# Altium schematic sheet Actionneur.SchDoc
size A4; SheetNumber: 6; SheetTotal: 7
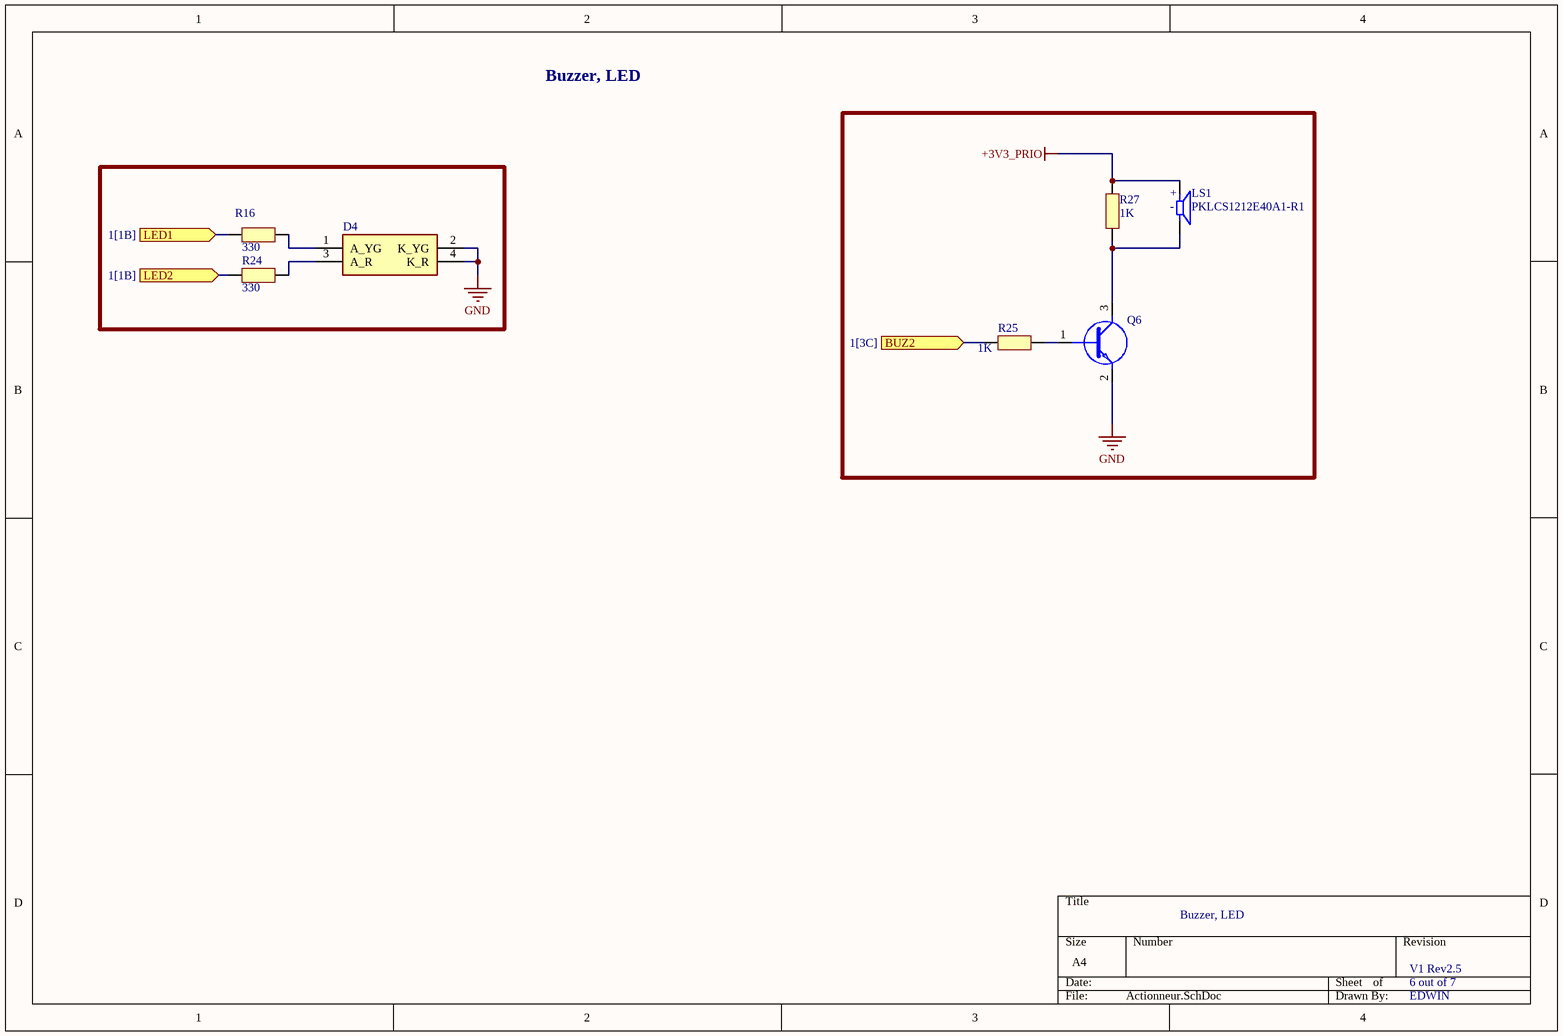
[diagram p0: Actionneur.SchDoc]

## Parts
D4  598-8610-207F  [5988610207F]  (value not drawn)
LS1  PKLCS1212E40A1-R1  [SPKR_PKLCS1212E40A1-R1]
Q6  SS8050-G  [SS8050-G]  (value not drawn)
R16  330  [RESC1005X06N]
R24  330  [RESC1005X06N]
R25  1K  [RESC1005X06N]
R27  1K  [RESC1005X06N]

## Ports
BUZ2 (in, see 1[3C]), LED1 (in, see 1[1B]), LED2 (in, see 1[1B])

## Nets
+3V3_PRIO: LS1.P R27.1
GND: D4.2(K_YG) D4.4(K_R) Q6.2(E)
BUZ2: R25.2 ; port BUZ2
LED1: R16.2 ; port LED1
LED2: R24.2 ; port LED2
NetD4_1: D4.1(A_YG) R16.1
NetD4_3: D4.3(A_R) R24.1
NetLS1_N: LS1.N Q6.3(C) R27.2
NetQ6_1: Q6.1(B) R25.1

## Notes on the sheet
- Buzzer, LED
- 6 out of 7
- V1 Rev2.5
- EDWIN
- (in symbol PKLCS1212E40A1-R1) +; -

## Library data of the parts
D4 = 598-8610-207F: Standard LEDs - SMD Red/Green WC 80/50mcd 645/570nm; Manufacturer_Name: Dialight; Geometry.Height: 0.8mm; Manufacturer_Part_Number: 598-8610-207F; Mouser Part Number: 645-598-8610-207F; Mouser Price/Stock: https://www.mouser.co.uk/ProductDetail/Dialight/598-8610-207F?qs=7JStj%2FjQ2SFuCjosqwklHQ%3D%3D; Arrow Part Number: 598-8610-207F; Arrow Price/Stock: https://www.arrow.com/en/products/598-8610-207f/dialight?region=nac; Datasheet Link: https://media.digikey.com/pdf/Data%20Sheets/Dialight%20PDFs/598%20Series%201210%20Pkg%20Bi-Color.pdf
LS1 = PKLCS1212E40A1-R1: Buzzers Transducer, Externally Driven Piezo 1.5V 2kHz 70dB @ 1.5V, 10cm Surface Mount Solder Pads; MF: Murata Electronics; Value: *; MP: PKLCS1212E40A1-R1; Package: None; Availability: Unavailable; Price: None
Q6 = SS8050-G: Bipolar Transistors - BJT NPN TRANSISTOR 1.5A 40V
R16 R24 R25 R27 = Resistor